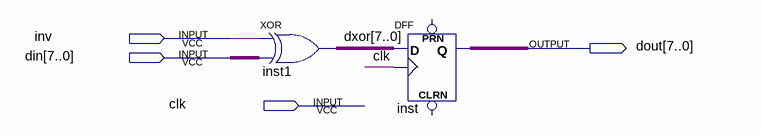
[diagram p0: schematic sheet]
// Quartus schematic test.bdf as structural Verilog: 2 symbols, 4 pins
module test (
  input  inv,
  input  [7:0] din,
  input  clk,
  output [7:0] dout
);

  wire [7:0] dxor;

  assign dxor = {8{inv}} ^ din;  // XOR inst1, 8 bits wide
  DFF inst[7:0] (.CLK(clk), .D(dxor), .Q(dout));  // open: CLRN, PRN
endmodule
